# Altium schematic sheet SAM_E54_Xplained_Pro_current_measurement_calibration.SchDoc: Current measurement calibration
size A3; Organization: ATMEL Norway; Address1: Vestre Rosten 79; Address2: N-7075 TILLER; Address3: NORWAY; DocumentNumber: A09-2748; Revision: 4; SheetNumber: 11; SheetTotal: 13; PageSetup: Record=PageOptions|CenterHorizontal=True|CenterVertical=True|PrintScale=1.01|XCorrection=1.00|YCorrection=1.00|PrintKind=1|BorderSize=5000000|LeftOffset=0|BottomOffset=0|Orientation=2|PaperLength=1000|PaperWidth=1000|Scale=100|PaperSource=7|PrintQuality=-4|MediaType=1|DitherType=10|PaperKind=A3 (297 x 420 mm)|PrintScaleMode=1
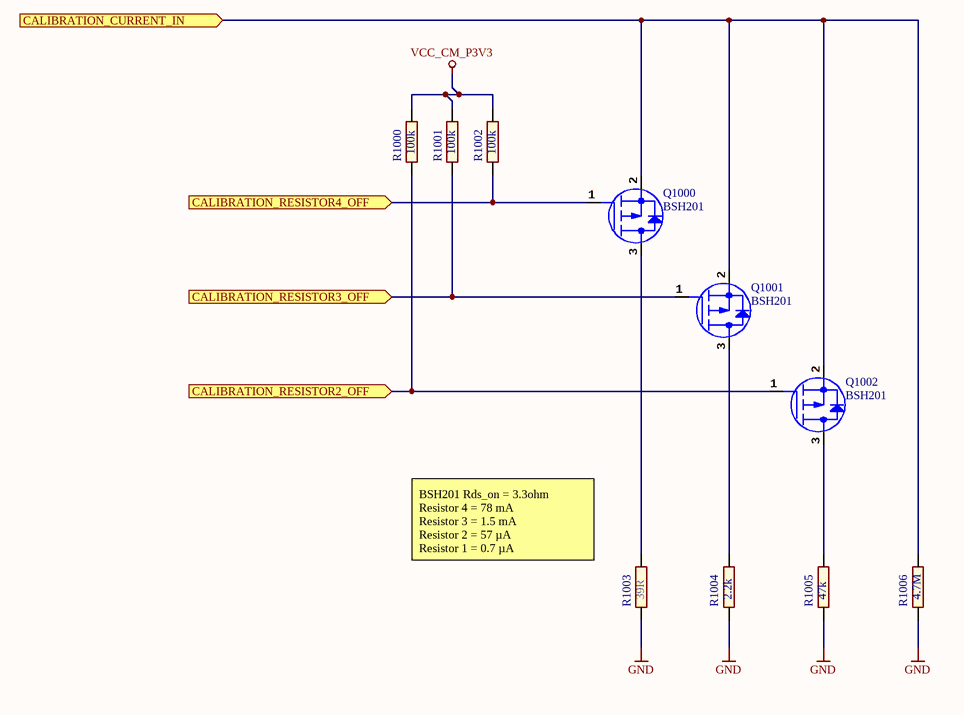
[diagram p0: SAM_E54_Xplained_Pro_current_measurement_calibration.SchDoc]

## Parts
Q1000  value BSH201  [AP5-00002]
Q1001  value BSH201  [AP5-00002]
Q1002  value BSH201  [AP5-00002]
R1000  value 100k  [AP2-00011]
R1001  value 100k  [AP2-00011]
R1002  value 100k  [AP2-00011]
R1003  value 39R  [AP2-00011]
R1004  value 2.2k  [AP2-00011]
R1005  value 47k  [AP2-00011]
R1006  value 4.7M  [AP2-00011]

## Ports
CALIBRATION_CURRENT_IN (in), CALIBRATION_RESISTOR2_OFF (in), CALIBRATION_RESISTOR3_OFF (in), CALIBRATION_RESISTOR4_OFF (in)

## Nets
GND: R1003.1 R1004.1 R1005.1 R1006.1
VCC_CM_P3V3: R1000.2 R1001.2 R1002.2
CALIBRATION_CURRENT_IN: Q1000.2(S) Q1001.2(S) Q1002.2(S) R1006.2 ; port CALIBRATION_CURRENT_IN
CALIBRATION_RESISTOR2_OFF: Q1002.1(G) R1000.1 ; port CALIBRATION_RESISTOR2_OFF
CALIBRATION_RESISTOR3_OFF: Q1001.1(G) R1001.1 ; port CALIBRATION_RESISTOR3_OFF
CALIBRATION_RESISTOR4_OFF: Q1000.1(G) R1002.1 ; port CALIBRATION_RESISTOR4_OFF
NetQ1000_3: Q1000.3(D) R1003.2
NetQ1001_3: Q1001.3(D) R1004.2
NetQ1002_3: Q1002.3(D) R1005.2

## Notes on the sheet
- (near R1003) BSH201 Rds_on = 3.3ohm
  Resistor 4 = 78 mA
  Resistor 3 = 1.5 mA
  Resistor 2 = 57 µA
  Resistor 1 = 0.7 µA
- Date:
- PAGE:
- of
- TITLE:
- Document number:
- Revision:

## Library data of the parts
Q1000-Q1002 = A05-0132: P-Channel Digital FET. -60V, -0.3A continuous, -1.2A Peak. RDS(ON)=2.5@VGS=-10V, RDS(ON)=<5 ohm @VGS=-2.5V. VGS(th)<1.9V; PartGroup: Transistors,Small signal FET,SMD; Manufacturer: NXP; MPN: BSH201,215; AN: A05-0132
R1000-R1002 = A02-0260: Thick film resistor, SMD 0402, 1/16W, 1%; PartGroup: Resistors,SMD,0402 1%; Manufacturer: ASJ; MPN: CR10-1003-FK; TemperatureRange: -55ï¿½ to +125ï¿½C; AN: A02-0260; Tolerance: 1 %; Height: 0,349999994039536
R1003 = A02-0178: Thick film resistor, SMD 0402, 1/16W, 1%; PartGroup: Resistors,SMD,0402 1%; Manufacturer: ASJ; MPN: CR10-39R0-FK; TemperatureRange: -55 - +125 deg C; AN: A02-0178; Tolerance: 1 %; Height: 0,349999994039536
R1004 = A02-0220: Thick film resistor, SMD 0402, 1/16W, 1%; PartGroup: Resistors,SMD,0402 1%; Manufacturer: ASJ; MPN: CR10-2201-FK; TemperatureRange: -55 - +125 deg C; AN: A02-0220; Tolerance: 1 %; Height: 0,349999994039536
R1005 = A02-0252: Thick film resistor, SMD 0402, 1/16W, 1%; PartGroup: Resistors,SMD,0402 1%; Manufacturer: KOA; MPN: RK73H1ETTP4702F; TemperatureRange: -55 - +125 deg C; AN: A02-0252; Tolerance: 1 %; Height: 0,349999994039536
R1006 = A02-0884: Thick film SMD 0402 1/16W 1%; PartGroup: Resistors,SMD,0402 1%; Manufacturer: YAGEO CORP; MPN: RC0402FR-074M7L; TemperatureRange: -55 Â°C to +155 Â°C; AN: A02-0884; Tolerance: 1 %